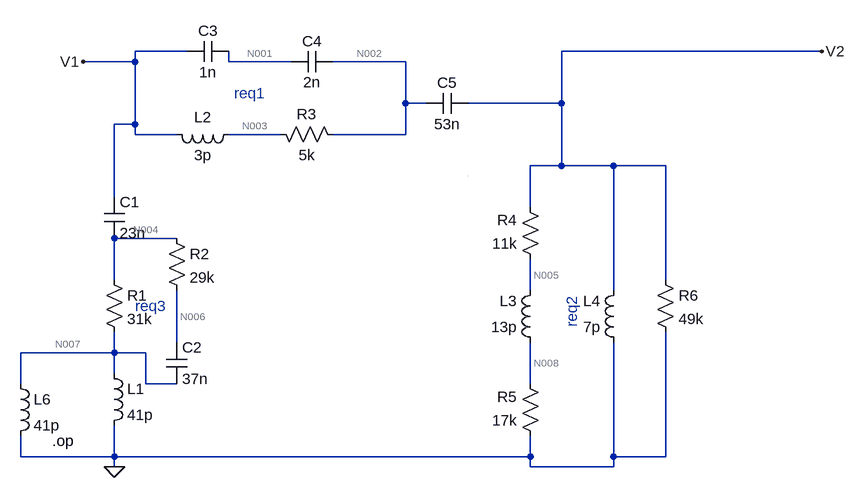
[diagram p0: schematic ejemplo 2.asc]
ejemplo 2.asc, the LTspice schematic file:
Version 4
SHEET 1 880 680
WIRE -432 -192 -512 -192
WIRE 544 -192 144 -192
WIRE -512 -176 -512 -192
WIRE -512 -176 -592 -176
WIRE -368 -176 -368 -192
WIRE -272 -176 -368 -176
WIRE -96 -176 -208 -176
WIRE -96 -112 -96 -176
WIRE -64 -112 -96 -112
WIRE 144 -112 144 -192
WIRE 144 -112 0 -112
WIRE -512 -80 -512 -176
WIRE -512 -80 -544 -80
WIRE -512 -64 -512 -80
WIRE -448 -64 -512 -64
WIRE -288 -64 -368 -64
WIRE -96 -64 -96 -112
WIRE -96 -64 -208 -64
WIRE 144 -16 144 -112
WIRE 144 -16 96 -16
WIRE 224 -16 144 -16
WIRE 304 -16 224 -16
WIRE -544 32 -544 -80
WIRE 96 48 96 -16
WIRE -448 96 -544 96
WIRE -544 160 -544 96
WIRE 304 160 304 -16
WIRE 96 176 96 128
WIRE 224 176 224 -16
WIRE -448 256 -448 176
WIRE -544 272 -544 240
WIRE -544 272 -688 272
WIRE -496 272 -544 272
WIRE -544 304 -544 272
WIRE -688 320 -688 272
WIRE -496 320 -496 272
WIRE -448 320 -496 320
WIRE 96 320 96 256
WIRE -688 432 -688 400
WIRE -544 432 -544 384
WIRE -544 432 -688 432
WIRE 96 432 96 400
WIRE 96 432 -544 432
WIRE 224 432 224 256
WIRE 304 432 304 240
WIRE 304 432 224 432
WIRE -544 448 -544 432
WIRE 96 448 96 432
WIRE 224 448 224 432
WIRE 224 448 96 448
WIRE 0 0 0 0
FLAG -544 448 0
FLAG -592 -176 V1
FLAG 544 -192 V2
SYMBOL res -560 144 R0
SYMATTR InstName R1
SYMATTR Value 31k
SYMBOL res -464 80 R0
SYMATTR InstName R2
SYMATTR Value 29k
SYMBOL res -192 -48 M270
WINDOW 0 32 56 VTop 2
WINDOW 3 0 56 VBottom 2
SYMATTR InstName R3
SYMATTR Value 5k
SYMBOL res 112 144 R180
WINDOW 0 36 76 Left 2
WINDOW 3 36 40 Left 2
SYMATTR InstName R4
SYMATTR Value 11k
SYMBOL res 112 416 R180
WINDOW 0 36 76 Left 2
WINDOW 3 36 40 Left 2
SYMATTR InstName R5
SYMATTR Value 17k
SYMBOL cap -560 32 R0
SYMATTR InstName C1
SYMATTR Value 23n
SYMBOL cap -464 256 R0
SYMATTR InstName C2
SYMATTR Value 37n
SYMBOL cap -368 -176 M270
WINDOW 0 32 32 VTop 2
WINDOW 3 0 32 VBottom 2
SYMATTR InstName C3
SYMATTR Value 1n
SYMBOL cap -208 -192 R90
WINDOW 0 0 32 VBottom 2
WINDOW 3 32 32 VTop 2
SYMATTR InstName C4
SYMATTR Value 2n
SYMBOL ind -560 288 R0
SYMATTR InstName L1
SYMATTR Value 41p
SYMBOL ind -352 -80 R90
WINDOW 0 5 56 VBottom 2
WINDOW 3 32 56 VTop 2
SYMATTR InstName L2
SYMATTR Value 3p
SYMBOL ind 112 272 R180
WINDOW 0 36 80 Left 2
WINDOW 3 36 40 Left 2
SYMATTR InstName L3
SYMATTR Value 13p
SYMBOL ind 240 272 R180
WINDOW 0 36 80 Left 2
WINDOW 3 36 40 Left 2
SYMATTR InstName L4
SYMATTR Value 7p
SYMBOL ind -704 304 R0
SYMATTR InstName L6
SYMATTR Value 41p
SYMBOL res 288 144 R0
SYMATTR InstName R6
SYMATTR Value 49k
SYMBOL cap 0 -128 R90
WINDOW 0 0 32 VBottom 2
WINDOW 3 32 32 VTop 2
SYMATTR InstName C5
SYMATTR Value 53n
TEXT -640 408 Left 2 !.op
TEXT -360 -128 Left 2 ;req1
TEXT 160 184 VRight 2 ;req2
TEXT -512 200 Left 2 ;req3

The netlist it stands for:
* ejemplo 2.asc
R1 N004 N007 31k
R2 N004 N006 29k
R3 N002 N003 5k
R4 N005 V2 11k
R5 0 N008 17k
C1 V1 N004 23n
C2 N006 N007 37n
C3 N001 V1 1n
C4 N002 N001 2n
L1 N007 0 41p
L2 N003 V1 3p
L3 N008 N005 13p
L4 0 V2 7p
L6 N007 0 41p
R6 V2 0 49k
C5 V2 N002 53n
.op
* req1
* req2
* req3
.backanno
.end

* Results of the author's LTspice run, read from the files saved beside the schematic
* Operating Point:
*   V(n004) = 0 V
*   V(n007) = 0 V
*   V(n006) = 0 V
*   V(n002) = 0 V
*   V(n003) = 0 V
*   V(n005) = 0 V
*   V(v2) = 0 V
*   V(n008) = 0 V
*   V(v1) = 0 V
*   V(n001) = 0 V
*   I(C5) = 0 A
*   I(C4) = 0 A
*   I(C3) = 0 A
*   I(C2) = 0 A
*   I(C1) = 0 A
*   I(L6) = 0 A
*   I(L4) = 0 A
*   I(L3) = 0 A
*   I(L2) = 0 A
*   I(L1) = 0 A
*   I(R6) = 0 A
*   I(R5) = 0 A
*   I(R4) = 0 A
*   I(R3) = 0 A
*   I(R2) = 0 A
*   I(R1) = 0 A